# Altium schematic sheet PowerSupply.SchDoc
size A4; Date: 07.06.2021; Author: Mateusz Mróz; CompanyName: AGH; DocumentNumber: 5; SheetNumber: 5; SheetTotal: 6
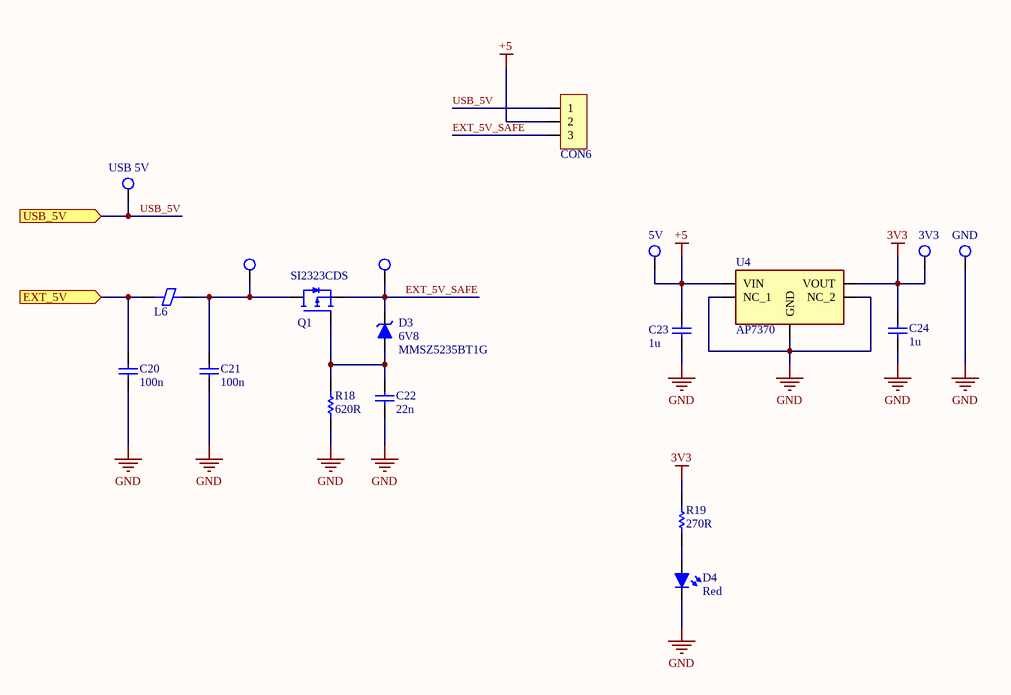
[diagram p0: PowerSupply.SchDoc]

## Parts
C20  100n  [Cap_0402_MD_outline]
C21  100n  [Cap_0402_MD_outline]
C22  22n  [Cap_0603_MD_outline]
C23  1u  [Cap_0805_MD_outline]
C24  1u  [Cap_0805_MD_outline]
CON6  Header 3  [HDR_1X3_2.54]  (value not drawn)
D3  MMSZ5235BT1G  Zener volatge: 6V8  [SOD3716X135N]
D4  Red  [LED_0805_OUTLINE]
L6  (no value)  [Bead_0402_MD_Outline]
Q1  SI2323CDS  [SOT95P237X112-3N]
R18  620R  [Res_0603_MD_outline]
R19  270R  [Res_0805_MD_outline]
TP16  USB 5V  [TP_SQ40]  (no BOM)
TP17  *  [TP_SQ40]  (value not drawn)  (no BOM)
TP18  *  [TP_SQ40]  (value not drawn)  (no BOM)
TP19  5V  [TP_SQ40]  (no BOM)
TP20  3V3  [TP_SQ40]  (no BOM)
TP21  GND  [TP_SQ40]  (no BOM)
U4  AP7370  [SOT95P285X140-5N]

## Ports
EXT_5V (in), USB_5V (in)

## Nets
3V3: C24.2 R19.2 TP20.1 U4.3(VOUT)
+5: C23.2 CON6.2 TP19.1 U4.1(VIN)
GND: C20.2 C21.1 C22.1 C23.1 C24.1 D4.K R18.1 TP21.1 U4.2(GND) U4.4(NC_1) U4.5(NC_2)
EXT_5V: C20.1 L6.1 ; port EXT_5V
EXT_5V_SAFE: CON6.3 D3.1(K) Q1.2(S) TP18.1
USB_5V: CON6.1 TP16.1 ; port USB_5V
NetC21_2: C21.2 L6.2 Q1.3(D) TP17.1
NetC22_2: C22.2 D3.2(A) Q1.1(G) R18.2
NetD4_A: D4.A R19.1

## Notes on the sheet
- University name:
- Degree course:
- 3th year electronics
- Date:
- Author:
- Student Index:
- Course:
- Checked by:
- PUE
- dr hab. inż. Cezary Worek, prof. AGH
- 305093
- Project name:
- Document name:
- Variant name:
- Sheet/all:
- /
- Version number:

## Library data of the parts
C20 C21 = Capacitor: MPN: GRM155R71H103MA88; Value: 100n; Package: 0402
C22 = Capacitor: MPN: GRM188R72A223KAC4D; Value: 22n; Package: 0603
C23 C24 = Capacitor: MPN: GRM219R7YA105KA12; Value: 1u; Package: 0805
CON6 = Header 3: Header, 3-Pin; MPN: G800LR305018EU
D3 = MMSZ5240BT1G: Zener Diode; MPN: MMSZ5235BT1G
D4 = LED: MPN: 599-0110-007F; Colour: Red
L6 = Bead: Ferrite bead; MPN: BLM15PX601SN1; Package: 0402
Q1 = SI2323CDS: P-MOSFET; MPN: SI2323CDS-T1-GE3
R18 = Resistor: MPN: CRCW0603620RFKEAC; Value: 620R; Package: 0603
R19 = Resistor: MPN: RCS0805270RFKEA; Value: 270R; Package: 0805
TP16-TP21 = TestPoint: Test point; HelpURL: *; MPN: *
  TP16: Value: USB 5V
  TP17 TP18: Value: *
  TP19: Value: 5V
  TP20: Value: 3V3
  TP21: Value: GND
U4 = AP7370-33WW-7: Volatge Regulator 3V3; Manufacturer_Name: Diodes Inc.; Datasheet Link: https://componentsearchengine.com/Datasheets/1/AP7370-33WW-7.pdf; Height: 1.4mm; Mouser Part Number: 621-AP7370-33WW-7; Mouser Price/Stock: https://www.mouser.co.uk/ProductDetail/Diodes-Incorporated/AP7370-33WW-7?qs=%252B6g0mu59x7LthBU4%252B8t%252BZQ%3D%3D; Arrow Part Number: AP7370-33WW-7; Arrow Price/Stock: https://www.arrow.com/en/products/ap7370-33ww-7/diodes-incorporated; MPN: AP7370-33WW-7